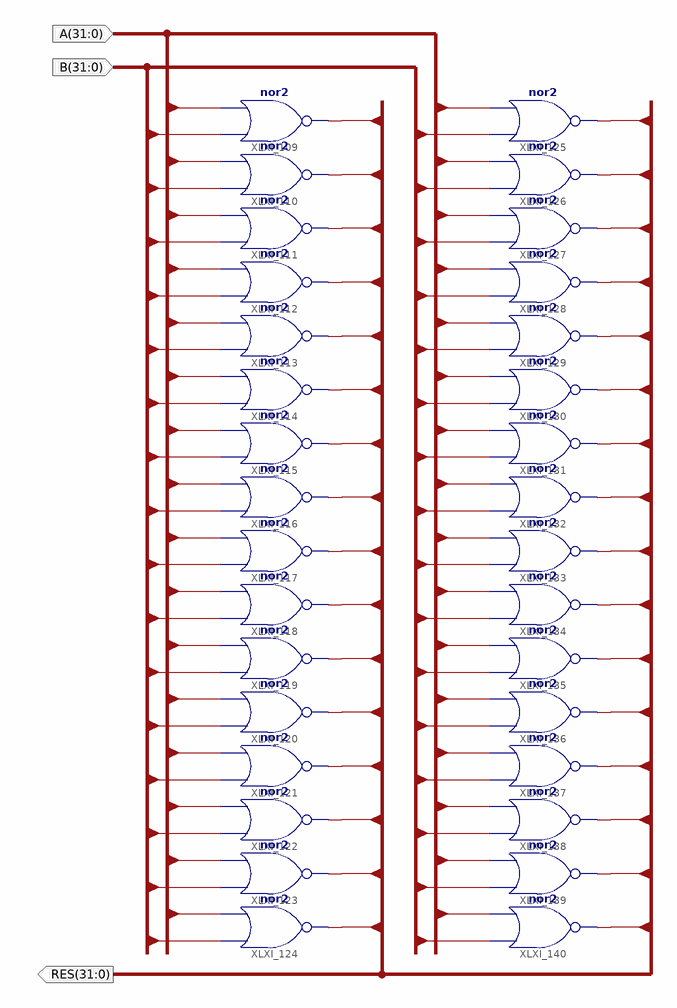
[diagram p0: schematic sheet 1]
// Xilinx ISE schematic op_nor32bit.sch (spartan3e) as structural Verilog: 32 symbols, 3 ports
module op_nor32bit (
  input  [31:0] B,
  input  [31:0] A,
  output [31:0] RES
);

  nor XLXI_109 (RES[31], B[31], A[31]);
  nor XLXI_110 (RES[30], B[30], A[30]);
  nor XLXI_111 (RES[29], B[29], A[29]);
  nor XLXI_112 (RES[28], B[28], A[28]);
  nor XLXI_113 (RES[27], B[27], A[27]);
  nor XLXI_114 (RES[26], B[26], A[26]);
  nor XLXI_115 (RES[25], B[25], A[25]);
  nor XLXI_116 (RES[24], B[24], A[24]);
  nor XLXI_117 (RES[23], B[23], A[23]);
  nor XLXI_118 (RES[22], B[22], A[22]);
  nor XLXI_119 (RES[21], B[21], A[21]);
  nor XLXI_120 (RES[20], B[20], A[20]);
  nor XLXI_121 (RES[19], B[19], A[19]);
  nor XLXI_122 (RES[18], B[18], A[18]);
  nor XLXI_123 (RES[17], B[17], A[17]);
  nor XLXI_124 (RES[16], B[16], A[16]);
  nor XLXI_125 (RES[15], B[15], A[15]);
  nor XLXI_126 (RES[14], B[14], A[14]);
  nor XLXI_127 (RES[13], B[13], A[13]);
  nor XLXI_128 (RES[12], B[12], A[12]);
  nor XLXI_129 (RES[11], B[11], A[11]);
  nor XLXI_130 (RES[10], B[10], A[10]);
  nor XLXI_131 (RES[9], B[9], A[9]);
  nor XLXI_132 (RES[8], B[8], A[8]);
  nor XLXI_133 (RES[7], B[7], A[7]);
  nor XLXI_134 (RES[6], B[6], A[6]);
  nor XLXI_135 (RES[5], B[5], A[5]);
  nor XLXI_136 (RES[4], B[4], A[4]);
  nor XLXI_137 (RES[3], B[3], A[3]);
  nor XLXI_138 (RES[2], B[2], A[2]);
  nor XLXI_139 (RES[1], B[1], A[1]);
  nor XLXI_140 (RES[0], B[0], A[0]);
endmodule
